# EasyEDA Pro project laserBordMain.eprj

# Schematic Schematic1
Create Date: 2023-06-17; Page Name: P1; Project Name: laserBordMain; Schematic Name: Schematic1; Update Date: 2023-08-22; Add into BOM: yes; Convert to PCB: yes; Drawed: 思达; Page Size: A3; Reviewed: 思达; Version: v1.0
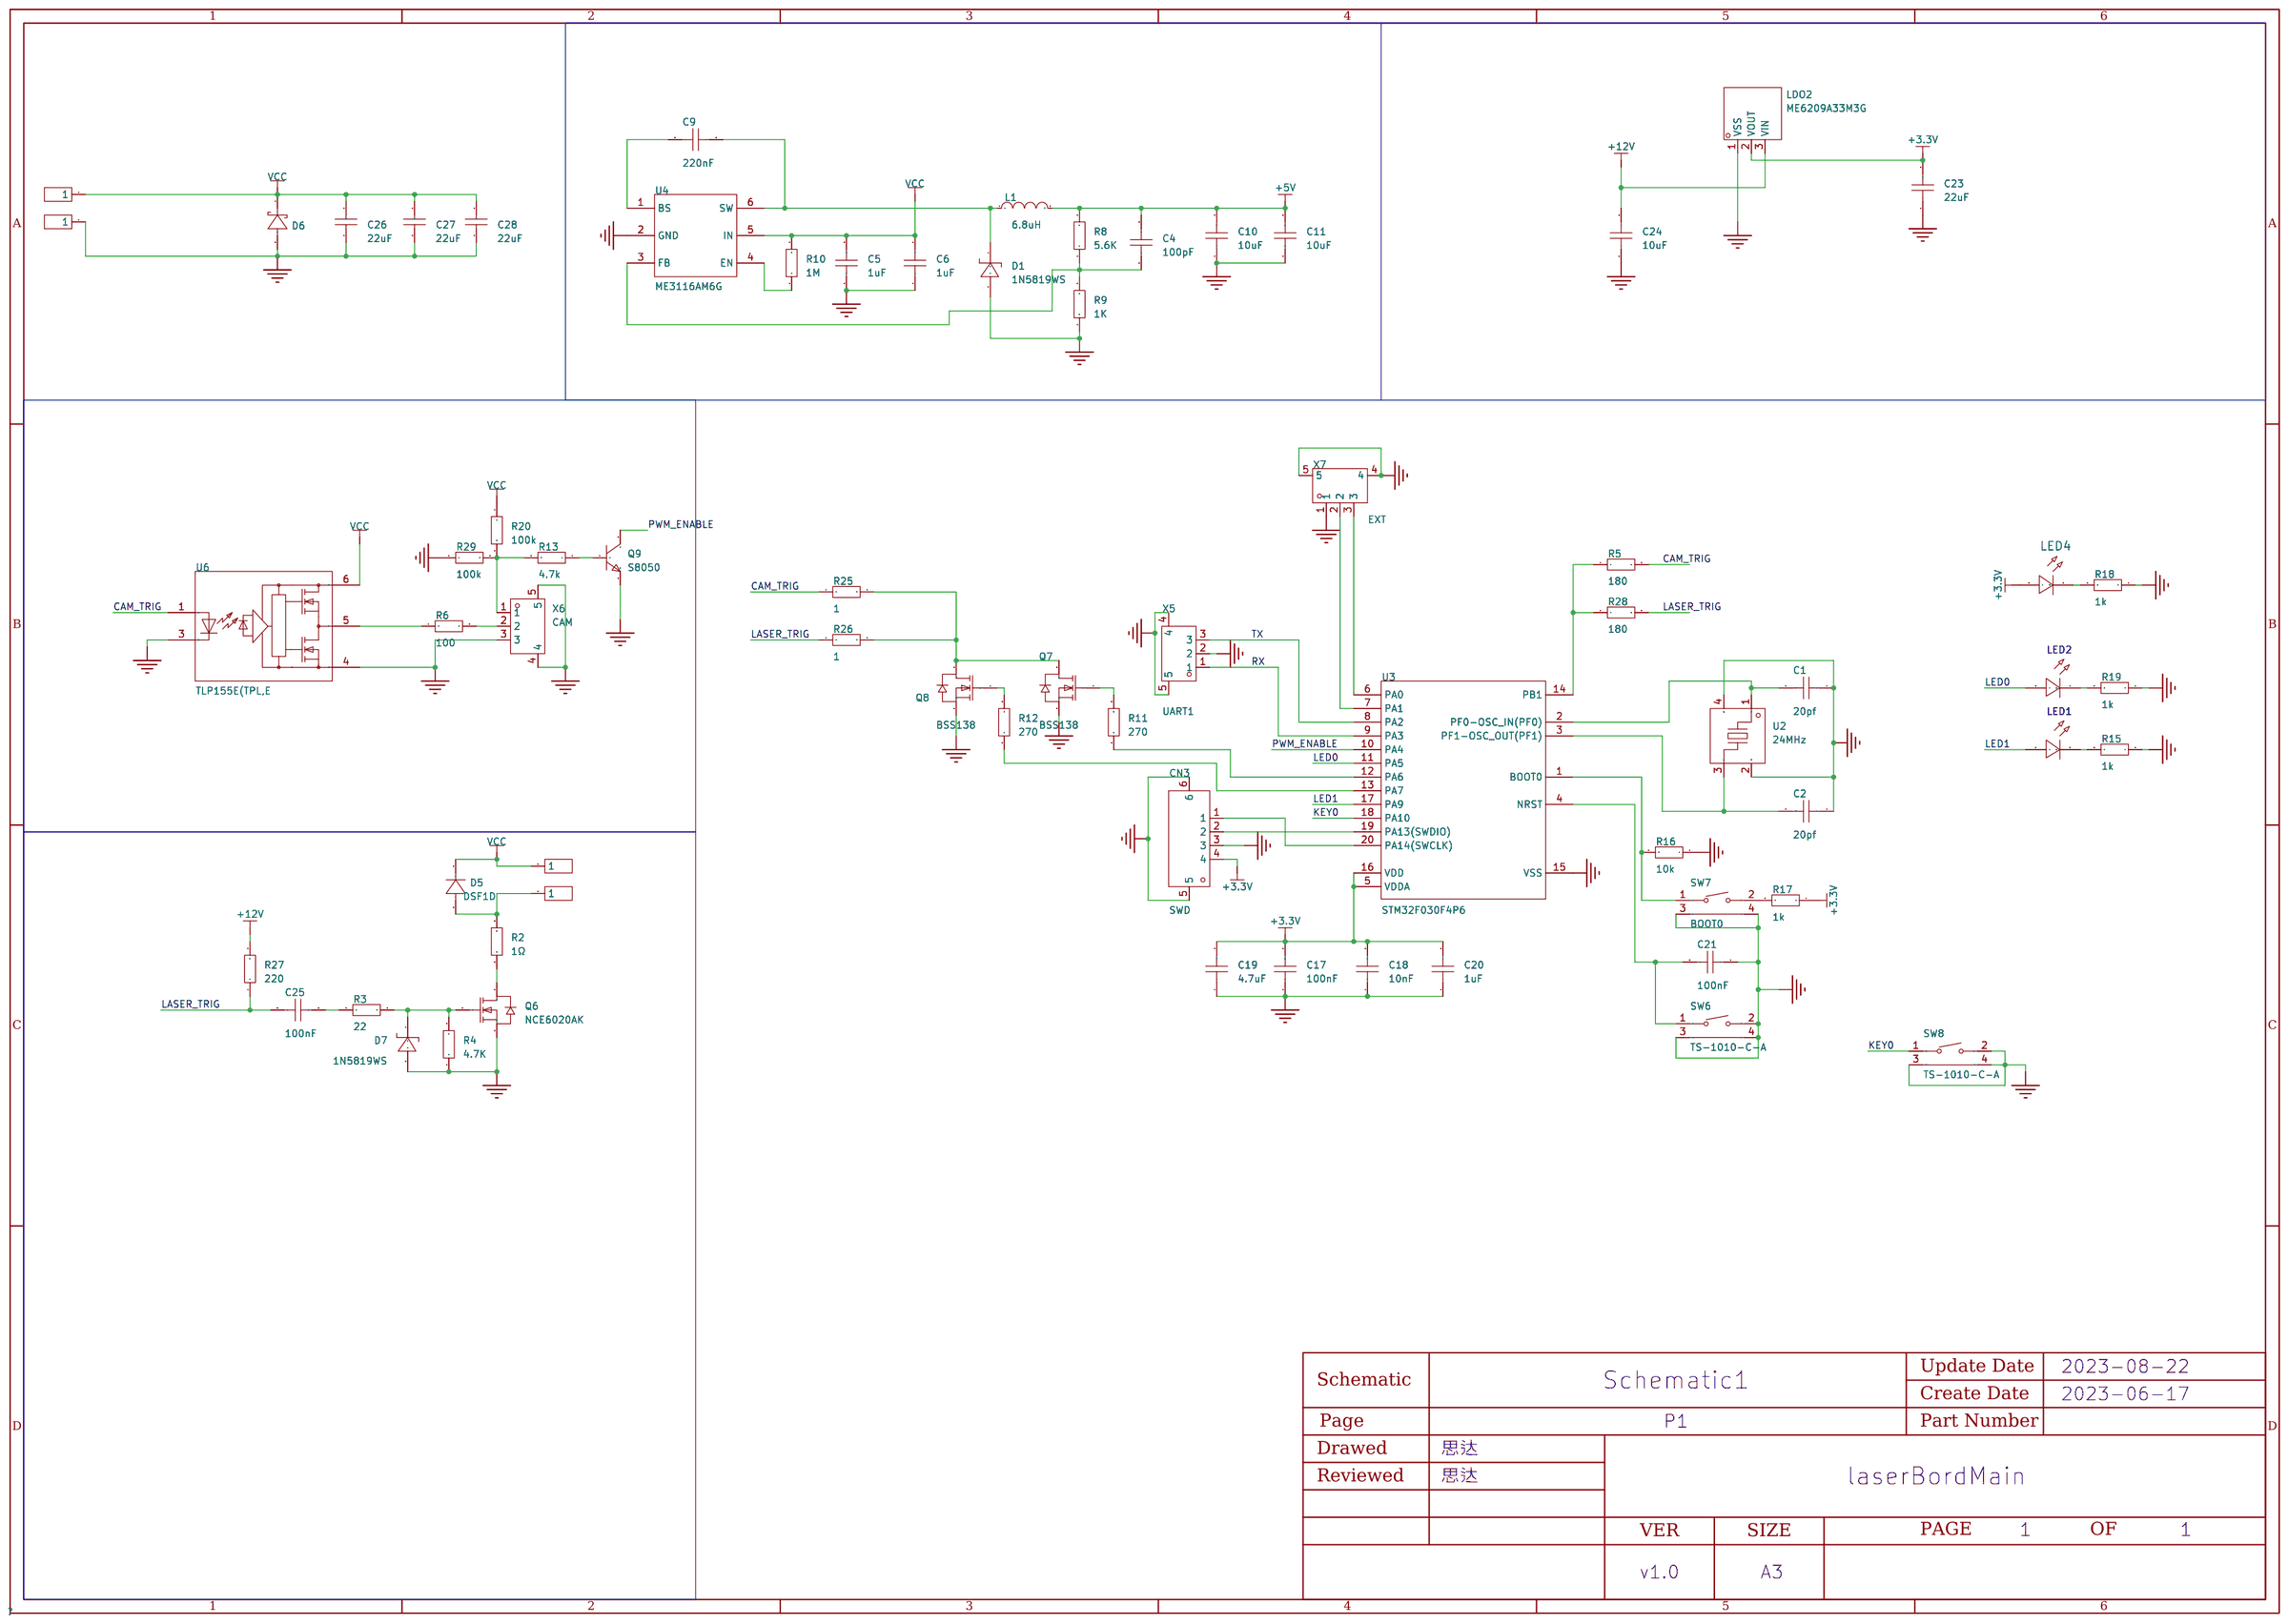
[diagram p0: schematic sheet]

## Parts
C1  20pf  [C0603]
C2  20pf  [C0603]
C4  100pF  [C0603]
C5  1uF  [C0805]
C6  1uF  [C0805]
C9  220nF  [C0603]
C10  10uF  [C0805]
C11  10uF  [C0805]
C17  100nF  [C0603]
C18  10nF  [C0603]
C19  4.7uF  [C0603]
C20  1uF  [C0603]
C21  100nF  [C0603]
C23  22uF  [C0603]
C24  10uF  [C0805]
C25  100nF  [C0603]
C26  22uF  [C1210]
C27  22uF  [C1210]
C28  22uF  [C1210]
CN3  SWD  [CONN-SMD_4P-P1.27_GH125-S04DCA-00]
D1  1N5819WS  [SOD-323_L1.8-W1.3-LS2.5-RD]
D5  DSF1D  [SOD-123_L2.8-W1.8-LS3.7-RD]
D6  SMAJ28A  [D-FLAT_L4.3-W2.6-LS5.3-RD]
D7  1N5819WS  [SOD-323_L1.8-W1.3-LS2.5-RD]
H1  -  [xt30_1p]
H2  -  [xt30_1p]
H3  -  [xt30_1p]
H4  -  [xt30_1p]
L1  6.8uH  [L1206]
LDO2  ME6209A33M3G  [SOT-23-3_L2.9-W1.6-P1.90-LS2.8-BR]
LED1  -  [LED_0603]
LED2  -  [LED_0603]
LED4  -  [LED_0603]
Q6  NCE6020AK  [TO-252-2_L6.6-W6.1-P4.57-LS10.1-TL-CW]
Q7  BSS138  [SOT-23-3_L2.9-W1.3-P1.90-LS2.4-BR]
Q8  BSS138  [SOT-23-3_L2.9-W1.3-P1.90-LS2.4-BR]
Q9  S8050  [SOT-23-3_L2.9-W1.6-P1.90-LS2.8-BR]
R2  1Ω  [R2010]
R3  22  [R0603]
R4  4.7K  [R0603]
R5  180  [R0603]
R6  100  [R0603]
R8  5.6K  [R0603]
R9  1K  [R0603]
R10  1M  [R0603]
R11  270  [R0603]
R12  270  [R0603]
R13  4.7k  [R0603]
R15  1k  [R0603]
R16  10k  [R0603]
R17  1k  [R0603]
R18  1k  [R0603]
R19  1k  [R0603]
R20  100k  [R0603]
R25  1  [R0603]
R26  1  [R0603]
R27  220  [R0603]
R28  180  [R0603]
R29  100k  [R0603]
SW6  TS-1010-C-A  [KEY-SMD_TX-1010-X-X]
SW7  BOOT0  [KEY-SMD_TX-1010-X-X]
SW8  TS-1010-C-A  [KEY-SMD_TX-1010-X-X]
U2  24MHz  [CRYSTAL-SMD_4P-L3.2-W2.5-BL]
U3  STM32F030F4P6  [TSSOP-20_L6.5-W4.4-P0.65-LS6.4-BL]
U4  ME3116AM6G  [SOT-23-6_L2.9-W1.6-P0.95-LS2.8-BL]
U6  TLP155E(TPL,E  [OPTO-SMD-5_L3.7-W4.6-P1.27-LS7.0-BR]
X5  UART1  [CONN-SMD_3P-P1.25_JUSHUO_GH125-S03DCA-00]
X6  CAM  [CONN-SMD_3P-P1.25_JUSHUO_GH125-S03DCA-00]
X7  EXT  [CONN-SMD_3P-P1.25_JUSHUO_GH125-S03DCA-00]

## Library data of the parts
C1 C2 C4 C9 C17-C21 C23 C25 = CAP_0603: Supplier Footprint: 0603
C5 C6 C10 C11 C24 = CAP_0805: Supplier Footprint: 0805
C26-C28 = GRM32DR71E106KA12L: 容值:10uF;精度:±10%;额定电压:25V;材质(温度系数):X7R;; LCSC Part Name: 10uF ±10% 25V; Supplier Part: C77100; Manufacturer: muRata(村田); Supplier Footprint: 1210; JLCPCB Part Class: Extended Part; Datasheet: https://atta.szlcsc.com/upload/public/pdf/source/20180326/C77100_23744D319E7E81B64F64A3609BA2ABFD.pdf; Supplier: LCSC; Tolerance: ±10%; Voltage Rated: 25V; Temperature Coefficient: X7R
CN3 = GH125-S04DCA-00: 参考系列:-;间距:1.25mm;插针结构:1x4P;排数:1;每排PIN数:4;行距:-;公母:公型插针;安装方式:卧贴;额定电流:1A;工作温度范围:-25℃~+85℃;; LCSC Part Name: GH1.25卧式贴片 带扣; Supplier Part: C2886767; Manufacturer: JS(钜硕电子); Supplier Footprint: SMD,P=1.25mm; JLCPCB Part Class: Extended Part; Datasheet: https://atta.szlcsc.com/upload/public/pdf/source/20210818/CD11791E5ED3EDF45A7009E9C8A2BD4C.pdf; Supplier: LCSC; Pitch: 1.25mm; Pins Structure: 1x4P; Number of Rows: 1; Number of PINs Per Row: 4; Gender: 公型插针; Mounting Style: 卧贴; Current Rating (Max): 1A; Operating Temperature Range: -25℃~+85℃
D1 D7 = 1N5819WS_C191023: 直流反向耐压(Vr):40V;平均整流电流(Io):1A;正向压降(Vf):600mV@1A;; LCSC Part Name: 40V 1A 600mV@1A; Supplier Part: C191023; Manufacturer: Hottech(合科泰); Supplier Footprint: SOD-323; JLCPCB Part Class: Basic Part; Datasheet: https://atta.szlcsc.com/upload/public/pdf/source/20220428/3CB86FD8D28D653594B4E35F9D5AEFD9.pdf; Supplier: LCSC; Reverse Voltage (Vr): 40V; Average Rectified Current (Io): 1A; Forward Voltage (Vf@If): 600mV@1A
D5 = DSF1D_C915614: 二极管配置:独立式;直流反向耐压(Vr):200V;平均整流电流(Io):1A;正向压降(Vf):950mV@1A;反向恢复时间(trr):35ns;; LCSC Part Name: 200V 1A 950mV@1A 35ns; Supplier Part: C915614; Manufacturer: FUXINSEMI(富芯森美); Supplier Footprint: SOD-123; JLCPCB Part Class: Extended Part; Datasheet: https://atta.szlcsc.com/upload/public/pdf/source/20220617/70FC00B35BDEA29A28FAEA4D4AB0042F.pdf; Supplier: LCSC; Diode Configuration: 独立式; Reverse Voltage (Vr): 200V; Average Rectified Current (Io): 1A; Forward Voltage (Vf@If): 950mV@1A; Reverse Leakage Current: 5uA@200V; Reverse Recovery Time (trr): 35ns; Operating Temperature: -55℃~+150℃@(Tj)
D6 = SMAJ28A_C1509532: Supplier Part: C1509532; Manufacturer: CJ(江苏长电/长晶); Supplier Footprint: SMAG; JLCPCB Part Class: Extended Part; Datasheet: https://atta.szlcsc.com/upload/public/pdf/source/20201222/C1509524_968BB56F728900F8495A6D352AF0B0FB.pdf; Supplier: LCSC
H1-H4 = HDR-M_2.54_1x1P: Supplier Part: C81276; Supplier Footprint: 插件; JLCPCB Part Class: Extended Part
L1 = L_1206
LDO2 = ME6209A33M3G: 输出类型:固定;输出极性:正;最大输入电压:18V;输出电压:3.3V;输出电流:250mA;电源纹波抑制比(PSRR):-;; LCSC Part Name: 正 Vin=18V Vout=3.3V 250mA; Supplier Part: C83508; Manufacturer: MICRONE(南京微盟); Supplier Footprint: SOT-23-3L; JLCPCB Part Class: Extended Part; Datasheet: https://atta.szlcsc.com/upload/public/pdf/source/20161212/1481539101152.pdf; Supplier: LCSC; Output Type: 固定; Output Polarity: 正; Number of Outputs: 1; Maximum Input Voltage: 18V; Output Voltage: 3.3V; Dropout Voltage: 80mV@(40mA); Output Current: 250mA
LED1 LED2 = LED_0603-B: Supplier Footprint: 0603
LED4 = LED_0603-R: Supplier Footprint: 0603
Q6 = NCE6020AK: 类型:N沟道;漏源电压(Vdss):60V;连续漏极电流(Id):20A;功率(Pd):45W;导通电阻(RDS(on)@Vgs,Id):35mΩ@10V,20A;阈值电压(Vgs(th)@Id):2.5V@250uA;; LCSC Part Name: N沟道 60V 20A; Supplier Part: C108639; Manufacturer: NCE(无锡新洁能); Supplier Footprint: TO-252-2(DPAK); JLCPCB Part Class: Extended Part; Datasheet: https://atta.szlcsc.com/upload/public/pdf/source/20170508/1494211006052.pdf; Supplier: LCSC; Type: N沟道; Drain Source Voltage (Vdss): 60V; Continuous Drain Current (Id): 20A; Power Dissipation (Pd): 45W; Drain Source On Resistance (RDS(on)@Vgs,Id): 35mΩ@10V,20A; Gate Threshold Voltage (Vgs(th)@Id): 2.5V@250uA
Q7 Q8 = BSS138_C78284: 类型:N沟道;漏源电压(Vdss):50V;连续漏极电流(Id):220mA;功率(Pd):360mW;导通电阻(RDS(on)@Vgs,Id):3.5Ω@10V,220mA;; LCSC Part Name: N沟道 50V 220mA; Supplier Part: C78284; Manufacturer: CJ(江苏长电/长晶); Supplier Footprint: SOT-23; JLCPCB Part Class: Extended Part; Datasheet: https://atta.szlcsc.com/upload/public/pdf/source/20160713/1468379865905.pdf; Supplier: LCSC; Type: N沟道; Drain Source Voltage (Vdss): 50V; Continuous Drain Current (Id): 220mA; Power Dissipation (Pd): 360mW; Drain Source On Resistance (RDS(on)@Vgs,Id): 3.5Ω@10V,220mA; Gate Threshold Voltage (Vgs(th)@Id): 1.5V@1mA
Q9 = S8050_C105433: 晶体管类型:NPN;集射极击穿电压(Vceo):25V;集电极电流(Ic):500mA;功率(Pd):300mW;直流电流增益(hFE@Ic,Vce):120@50mA,1V;; LCSC Part Name: NPN 25V 500mA L档 120-200; Supplier Part: C105433; Manufacturer: CJ(江苏长电/长晶); Supplier Footprint: SOT-23; JLCPCB Part Class: Extended Part; Datasheet: https://atta.szlcsc.com/upload/public/pdf/source/20170415/1492237762328.pdf; Supplier: LCSC; Transistor Type: NPN; Collector-Emitter Breakdown Voltage (Vceo): 25V; Collector Current (Ic): 500mA; Power Dissipation (Pd): 300mW; Collector Cut-Off Current (Icbo): 100nA; Collector-Emitter Saturation Voltage (VCE(sat)@Ic,Ib): 600mV@500mA,50mA; DC Current Gain (hFE@Ic,Vce): 120@50mA,1V; Transition Frequency (fT): 150MHz; Operating Temperature: +150℃@(Tj)
R2 = 201007J0000T4E: 电阻类型:厚膜电阻;阻值:0Ω;精度:±5%;功率:750mW;; LCSC Part Name: 0Ω ±5% 750mW; Supplier Part: C270958; Manufacturer: UNI-ROYAL(厚声); Supplier Footprint: 2010; JLCPCB Part Class: Extended Part; Datasheet: https://atta.szlcsc.com/upload/public/pdf/source/20200306/C422600_1E6D84923E4A46A82E41ADD87F860B5C.pdf; Supplier: LCSC; Type: 厚膜电阻; Tolerance: ±5%; Power(Watts): 750mW; Overload Voltage (Max): 200V; Operating Temperature Range: -55℃~+155℃
R3-R6 R8-R13 R15-R20 R25-R29 = Res_0603: Supplier Footprint: 0603
SW6-SW8 = TS-1010-C-A: 触点电流:50mA;额定电压(DC):12V;绝缘电阻:-;电路结构:单刀单掷;安装方式:卧贴;带灯:无;作用力:260gf;机械寿命:10万次;带支架:否;; LCSC Part Name: 卧贴 2*4*3.5mm 轻触开关; Supplier Part: C692458; Manufacturer: XKB Connectivity(中国星坤); Supplier Footprint: SMD; JLCPCB Part Class: Extended Part; Datasheet: https://atta.szlcsc.com/upload/public/pdf/source/20211011/09621D275CE0F472C941775DFBBCCC96.pdf; Supplier: LCSC; Contact Current: 50mA; Voltage Rating (DC): 12V; Circuit: 单刀单掷; Mounting Style: 卧贴; Actuator Style: 矩形按钮; Actuator/Cap Color: 黑色; With Lamp: 无; Operating Force: 260gf; Mechanical Life: 10万次; Operating Temperature: -30℃~+85℃; Switch Length: 2mm; Switch Width: 4mm; Switch Height: 3.5mm; Strike Gundam: 否
U2 = XXHCCLNANF-24MHZ: 频率:24MHz;频率公差:±20ppm;负载电容:20pF;; Supplier Part: C5160135; Manufacturer: TAITIEN(泰艺电子); Supplier Footprint: SMD3225-4P; JLCPCB Part Class: Extended Part; Datasheet: https://atta.szlcsc.com/upload/public/pdf/source/20221011/C6169EE059BEE5ABCF35F509F47C6D34.pdf; Supplier: LCSC; Crystal Type: 贴片无源晶振; Frequency Tolerance: ±20ppm; Frequency Stability: ±20ppm; Load Capacitance: 20pF; Operating Temperature: -40℃~+85℃
U3 = STM32F030F4P6: CPU内核:ARM Cortex-M0;CPU最大主频:48MHz;程序存储容量:16KB;程序存储器类型:FLASH;RAM总容量:4KB;GPIO端口数量:15;; LCSC Part Name: ARM Cortex-M0 48MHz; Supplier Part: C32908; Manufacturer: ST(意法半导体); Supplier Footprint: TSSOP-20; JLCPCB Part Class: Extended Part; Datasheet: https://atta.szlcsc.com/upload/public/pdf/source/20140704/1457707098580.pdf; Supplier: LCSC; CPU Core: ARM Cortex-M0; CPU Maximum Speed: 48MHz; Operating Voltage Range: 2.4V~3.6V; Program Storage Size: 16KB; Program Memory Type: FLASH; RAM Size: 4KB; GPIO Ports Number: 15; ADC (Bit): 12bit; Watchdog: 有; Low-Voltage Detect: 有; Direct Memory Access: 有; Internal Oscillator: 有; Operating Temperature Range: -40℃~+85℃
U4 = ME3116AM6G_C97643: 功能类型:降压型;同步整流:-;输出通道数:-;拓扑结构:-;输入电压:-;输出电流(最大值):-;开关频率:-;; LCSC Part Name: 降压型; Supplier Part: C97643; Manufacturer: MICRONE(南京微盟); Supplier Footprint: SOT-23-6; JLCPCB Part Class: Extended Part; Datasheet: https://atta.szlcsc.com/upload/public/pdf/source/20170322/1490151692992.pdf; Supplier: LCSC; Function: 降压型
U6 = TLP155E(TPL,E: Supplier Part: C56499; Manufacturer: TOSHIBA(东芝); Supplier Footprint: SO-5; JLCPCB Part Class: Extended Part; Datasheet: https://atta.szlcsc.com/upload/public/pdf/source/20150821/1457707350132.pdf; Supplier: LCSC
X5-X7 = GH125-S03DCA-00: 参考系列:-;间距:1.25mm;插针结构:1x3P;排数:1;每排PIN数:3;行距:-;公母:公型插针;安装方式:卧贴;额定电流:1A;工作温度范围:-25℃~+85℃;; LCSC Part Name: GH1.25卧式贴片 带扣; Supplier Part: C2886766; Manufacturer: JS(钜硕电子); Supplier Footprint: SMD,P=1.25mm; JLCPCB Part Class: Extended Part; Datasheet: https://atta.szlcsc.com/upload/public/pdf/source/20210818/CD11791E5ED3EDF45A7009E9C8A2BD4C.pdf; Supplier: LCSC; Pitch: 1.25mm; Pins Structure: 1x3P; Number of Rows: 1; Number of PINs Per Row: 3; Gender: 公型插针; Mounting Style: 卧贴; Current Rating (Max): 1A; Operating Temperature Range: -25℃~+85℃

## Nets
+3.3V: C17.2 C18.2 C19.2 C20.2 C23.2 CN3.4 LDO2.2(VOUT) LED4.2(A) R17.1 U3.5(VDDA) U3.16(VDD)
+5V: C4.2 C10.2 C11.2 L1.2 R8.2
+12V: C24.2 LDO2.3(VIN) R27.2
GND: C1.1 C2.1 C5.1 C6.1 C10.1 C11.1 C17.1 C18.1 C19.1 C20.1 C21.1 C23.1 C24.1 C26.1 C27.1 C28.1 CN3.3 CN3.5 CN3.6 D1.2(A) D6.2(K) D7.2(A) H2.1 LDO2.1(VSS) Q6.3(S) Q7.2(S) Q8.2(S) Q9.2 R4.1 R9.1 R15.1 R16.1 R18.1 R19.1 R29.1 SW6.2 SW6.3 SW6.4 SW7.3 SW7.4 SW8.2 SW8.3 SW8.4 U2.2(GND) U2.4(GND) U3.15(VSS) U4.2(GND) U6.3(CAT) U6.4(GND) X5.2 X5.4 X5.5 X6.3 X6.4 X6.5 X7.1 X7.4 X7.5
VCC: C5.2 C6.2 C26.2 C27.2 C28.2 D5.1(K) D6.1(A) H1.1 H3.1 R10.2 R20.1 U4.5(IN) U6.6(VCC)
CAM_TRIG: R5.2 R25.1 U6.1(AN)
KEY0: SW8.1 U3.18(PA10)
LASER_TRIG: C25.1 R26.1 R27.1 R28.2
LED0: LED2.2(A) U3.11(PA5)
LED1: LED1.2(A) U3.17(PA9)
PWM_ENABLE: Q9.3 U3.10(PA4)
RX: U3.9(PA3) X5.1
TX: U3.8(PA2) X5.3
$1N1626: C2.2 U2.3 U3.3(PF1-OSC_OUT(PF1))
$1N1631: C1.2 U2.1 U3.2(PF0-OSC_IN(PF0))
$1N4476: D5.2(A) H4.1 R2.2
$1N5670: Q6.2(D) R2.1
$1N6510: R10.1 U4.4(EN)
$1N6730: C9.1 U4.1(BS)
$1N6734: C9.2 D1.1(C) L1.1 U4.6(SW)
$1N6947: C4.1 R8.1 R9.2 U4.3(FB)
$1N7197: Q8.1(G) R12.2
$1N7201: Q7.1(G) R11.2
$1N8162: CN3.1 U3.20(PA14(SWCLK))
$1N8168: CN3.2 U3.19(PA13(SWDIO))
$1N8540: R16.2 SW7.1 U3.1(BOOT0)
$1N8553: C21.2 SW6.1 U3.4(NRST)
$1N8819: R17.2 SW7.2
$1N8855: R11.1 U3.12(PA6)
$1N8868: R12.1 U3.13(PA7)
$1N8989: LED4.1(C) R18.2
$1N12018: LED2.1(C) R19.2
$1N12023: LED1.1(C) R15.2
$1N16258: U3.7(PA1) X7.2
$1N16262: U3.6(PA0) X7.3
$1N21791: Q9.1 R13.1
$1N21794: R13.2 R20.2 R29.2 X6.1
$1N21871: R6.1 U6.5(VO)
$1N21926: R6.2 X6.2
$1N25303: Q7.3(D) Q8.3(D) R25.2 R26.2
$1N25434: R5.1 R28.1 U3.14(PB1)
$1N26982: D7.1(C) Q6.1(G) R3.2 R4.2
$1N26993: C25.2 R3.1

# Board PCB1
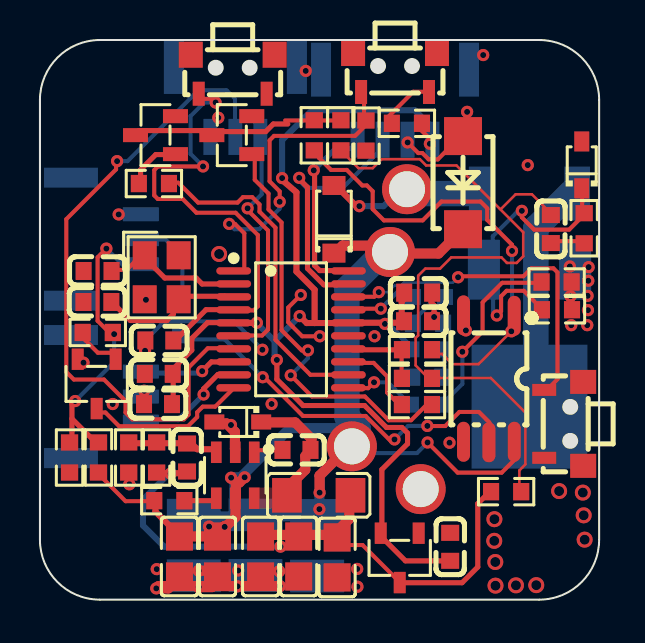
[diagram p1: board, top side]
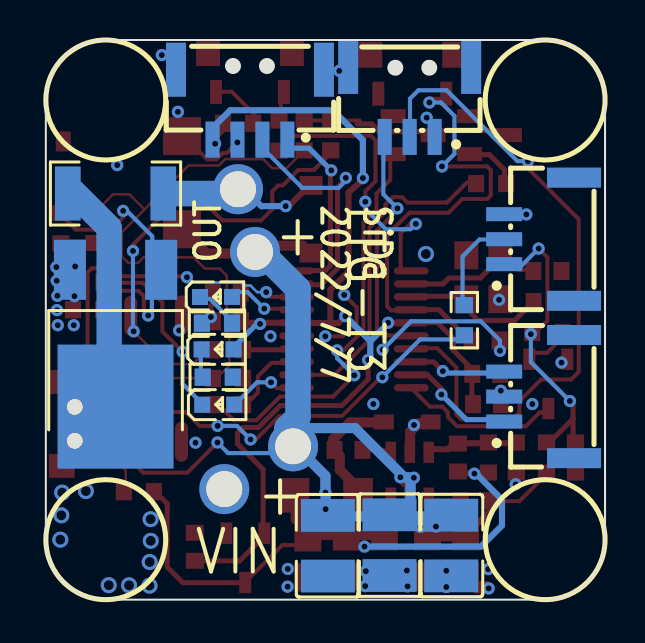
[diagram p2: board, bottom side, seen from below]

Outline 28 x 28 mm; copper layers: Top Layer, Bottom Layer. Coordinates in mm from the lower left corner of the outline.
Outline path: 0,25 arc(0.88,27.12) 3,28 25,28 arc(27.12,27.12) 28,25 28,3 arc(27.12,0.88) 25,0 3,0 arc(0.88,0.88) 0,3 0,25
Stack: Top Layer 0.035mm / Dielectric1 1.11mm FR4 er 4.5 / Bottom Layer 0.035mm

## Design rules (mm)
template: 自定义配置
spacing copperThickness1oz (default): track to track 0.102, other pairs 0.152 to 0.3
spacing copperThickness2oz: track to track 0.203, other pairs 0.152 to 0.3
track width copperThickness1oz (default): min 0.127, default 0.254, max 2.54
track width copperThickness2oz: min 0.203, default 0.254, max 2.54
differential pair differentialPair (default): width min 0.127, default 0.254, max 2.54; gap min 0.152, default 0.152
via viaSize (default): diameter min 0.5, default 0.61, max 10; hole min 0.3, default 0.305, max 6.3
net GND uses copperRegion1

## Placement (name value [footprint] x y rotation side)
C1  20pf  [C0603]  2.89 16.44 0 top
C2  20pf  [C0603]  2.88 14.89 0 top
C4  100pF  [C0603]  7.37 7.11 270 top
C5  1uF  [C0805]  6.98 2.16 90 top
C6  1uF  [C0805]  8.89 2.16 90 top
C9  220nF  [C0603]  12.85 7.49 0 top
C10  10uF  [C0805]  11.05 2.16 90 top
C11  10uF  [C0805]  12.95 2.16 90 top
C17  100nF  [C0603]  18.94 15.36 180 top
C18  10nF  [C0603]  5.95 11.3 0 top
C19  4.7uF  [C0603]  18.93 13.93 180 top
C20  1uF  [C0603]  5.91 9.78 0 top
C21  100nF  [C0603]  5.98 12.97 0 top
C23  22uF  [C0603]  20.54 2.64 270 top
C24  10uF  [C0805]  14.88 2.11 90 top
C25  100nF  [C0603]  25.58 18.54 270 top
C26  22uF  [C1210]  13.88 2.7 90 bottom
C27  22uF  [C1210]  10.79 2.72 90 bottom
C28  22uF  [C1210]  7.7 2.71 90 bottom
CN3  SWD  [CONN-SMD_4P-P1.27_GH125-S04DCA-00]  17.78 24.77 0 bottom
D1  1N5819WS  [SOD-323_L1.8-W1.3-LS2.5-RD]  9.91 8.89 180 top
D5  DSF1D  [SOD-123_L2.8-W1.8-LS3.7-RD]  14.72 19.03 90 top
D6  SMAJ28A  [D-FLAT_L4.3-W2.6-LS5.3-RD]  21.18 20.86 90 top
D7  1N5819WS  [SOD-323_L1.8-W1.3-LS2.5-RD]  27.13 21.75 90 top
H1  -  [xt30_1p]  17.53 17.4 300 top
H2  -  [xt30_1p]  19.07 5.53 270 top
H3  -  [xt30_1p]  15.62 7.67 0 top
H4  -  [xt30_1p]  18.38 20.54 0 top
L1  6.8uH  [L1206]  13.96 5.22 0 top
LDO2  ME6209A33M3G  [SOT-23-3_L2.9-W1.6-P1.90-LS2.8-BR]  18.01 2.09 90 top
LED1  -  [LED_0603]  19.43 15.15 180 bottom
LED2  -  [LED_0603]  19.32 9.76 180 bottom
LED4  -  [LED_0603]  19.35 12.53 180 bottom
Q6  NCE6020AK  [TO-252-2_L6.6-W6.1-P4.57-LS10.1-TL-CW]  24.51 13.08 270 bottom
Q7  BSS138  [SOT-23-3_L2.9-W1.3-P1.90-LS2.4-BR]  5.78 23.24 0 top
Q8  BSS138  [SOT-23-3_L2.9-W1.3-P1.90-LS2.4-BR]  9.61 23.24 0 top
Q9  S8050  [SOT-23-3_L2.9-W1.6-P1.90-LS2.8-BR]  2.84 10.8 90 top
R2  1Ω  [R2010]  24.51 20.32 180 bottom
R3  22  [R0603]  27.25 18.58 90 top
R4  4.7K  [R0603]  25.89 14.51 180 top
R5  180  [R0603]  18.88 12.51 0 top
R6  100  [R0603]  7.05 13.98 90 bottom
R8  5.6K  [R0603]  5.84 7.11 270 top
R9  1K  [R0603]  4.44 7.11 90 top
R10  1M  [R0603]  6.48 4.95 180 top
R11  270  [R0603]  5.71 20.82 180 top
R12  270  [R0603]  18.88 9.76 0 top
R13  4.7k  [R0603]  2.9 13.37 0 top
R15  1k  [R0603]  19.43 13.83 180 bottom
R16  10k  [R0603]  16.32 23.22 90 top
R17  1k  [R0603]  18.37 23.83 180 top
R18  1k  [R0603]  19.39 11.13 0 bottom
R19  1k  [R0603]  25.87 15.89 180 top
R20  100k  [R0603]  2.93 7.11 90 top
R25  1  [R0603]  13.74 23.23 90 top
R26  1  [R0603]  15.07 23.23 90 top
R27  220  [R0603]  23.34 5.4 180 top
R28  180  [R0603]  18.88 11.07 0 top
R29  100k  [R0603]  1.48 7.11 90 top
SW6  TS-1010-C-A  [KEY-SMD_TX-1010-X-X]  9.65 26.29 0 top
SW7  BOOT0  [KEY-SMD_TX-1010-X-X]  17.78 26.37 0 top
SW8  TS-1010-C-A  [KEY-SMD_TX-1010-X-X]  26.23 8.8 270 top
U2  24MHz  [CRYSTAL-SMD_4P-L3.2-W2.5-BL]  6.1 16.13 270 top
U3  STM32F030F4P6  [TSSOP-20_L6.5-W4.4-P0.65-LS6.4-BL]  12.57 13.52 270 top
U4  ME3116AM6G  [SOT-23-6_L2.9-W1.6-P0.95-LS2.8-BL]  9.78 6.22 180 top
U6  TLP155E(TPL,E  [OPTO-SMD-5_L3.7-W4.6-P1.27-LS7.0-BR]  22.48 11.05 90 top
X5  UART1  [CONN-SMD_3P-P1.25_JUSHUO_GH125-S03DCA-00]  3.3 10.16 90 bottom
X6  CAM  [CONN-SMD_3P-P1.25_JUSHUO_GH125-S03DCA-00]  3.3 18.03 90 bottom
X7  EXT  [CONN-SMD_3P-P1.25_JUSHUO_GH125-S03DCA-00]  9.78 24.9 0 bottom

## Footprints (pads in the part's own frame, mm; a bottom-side part is the same pattern mirrored in y, then rotated)
C0603
  rect 0.8x0.9 smd: 1(-0.7,0) 2(0.7,0)
C0805
  rect 1.41x1.35 smd: 1(-1,0) 2(1,0)
C1210
  rect 1.635x2.7 smd: 1(-1.518,0) 2(1.518,0)
CONN-SMD_3P-P1.25_JUSHUO_GH125-S03DCA-00
  rect 0.7x1.8 smd: 1(-1.25,1.75) 2(0,1.75) 3(1.25,1.75)
  rect 1x2.7 smd: 4(3.08,-1.75) 5(-3.08,-1.75)
CONN-SMD_4P-P1.27_GH125-S04DCA-00
  rect 0.7x1.8 smd: 1(-1.875,1.75) 2(-0.625,1.75) 3(0.625,1.75) 4(1.875,1.75)
  rect 1x2.7 smd: 5(3.705,-1.75) 6(-3.705,-1.75)
CRYSTAL-SMD_4P-L3.2-W2.5-BL
  rect 1.4x1.2 smd: 1(-1.1,-0.85) 2(1.1,-0.85) 3(1.1,0.85) 4(-1.1,0.85)
D-FLAT_L4.3-W2.6-LS5.3-RD
  rect 1.9x1.9 smd: 1(-2.33,0) 2(2.33,0)
KEY-SMD_TX-1010-X-X
  rect 0.6x1.2 smd: 1(-1.7,-0.975) 2(1.7,-0.975)
  rect 1.2x1.3 smd: 3(-2.1,0.975) 4(2.1,0.975)
L1206
  rect 1.485x1.728 smd: 1(-1.593,0) 2(1.593,0)
LED_0603
  rect 0.8x0.8 smd: 1(-0.851,-0.01) 2(0.75,-0.005)
OPTO-SMD-5_L3.7-W4.6-P1.27-LS7.0-BR
  oval 2x0.65 smd: 1(3.15,-1.27) 3(3.175,1.27) 4(-3.15,1.27) 5(-3.175,0) 6(-3.15,-1.27)
R0603
  rect 0.806x0.864 smd: 1(-0.753,0) 2(0.753,0)
R2010
  rect 1.282x2.7 smd: 1(-2.391,0) 2(2.391,0)
SOD-123_L2.8-W1.8-LS3.7-RD
  rect 0.95x1.15 smd: 1(-1.692,0) 2(1.692,0)
SOD-323_L1.8-W1.3-LS2.5-RD
  rect 1x0.75 smd: 1(-1.173,0) 2(1.173,0)
SOT-23-3_L2.9-W1.3-P1.90-LS2.4-BR
  rect 1.25x0.7 smd: 1(1,-0.95) 2(1,0.95) 3(-1,0)
SOT-23-3_L2.9-W1.6-P1.90-LS2.8-BR
  rect 1.07x0.6 smd: 1(1.235,-0.95) 2(1.235,0.95) 3(-1.235,0)
SOT-23-6_L2.9-W1.6-P0.95-LS2.8-BL
  rect 0.532x1.072 smd: 1(-0.95,-1.149) 2(0,-1.149) 3(0.95,-1.149) 4(0.95,1.149) 5(0,1.149) 6(-0.95,1.149)
TO-252-2_L6.6-W6.1-P4.57-LS10.1-TL-CW
  rect 3x1.6 smd: 1(-3.424,2.285) 3(-3.424,-2.285)
  rect 6.2x5.8 smd: 2(3.424,0)
TSSOP-20_L6.5-W4.4-P0.65-LS6.4-BL
  oval 0.364x1.742 smd: 1(-2.925,-2.871) 2(-2.275,-2.871) 3(-1.625,-2.871) 4(-0.975,-2.871) 5(-0.325,-2.871) 6(0.325,-2.871) 7(0.975,-2.871) 8(1.625,-2.871) 9(2.275,-2.871) 10(2.925,-2.871) 11(2.925,2.871) 12(2.275,2.871) 13(1.625,2.871) 14(0.975,2.871) 15(0.325,2.871) 16(-0.325,2.871) 17(-0.975,2.871) 18(-1.625,2.871) 19(-2.275,2.871) 20(-2.925,2.871)
xt30_1p
  round 2.5 hole 1.8: 1(0,0)

## Nets
As in the schematic, except:
+12V: C4.2 C10.2 C11.2 C24.2 L1.2 LDO2.3 R8.2 R27.2

## Via types
v1: diameter 0.8, hole 0.5, Top Layer to Bottom Layer, 11 vias
v2: diameter 0.61, hole 0.305, Top Layer to Bottom Layer, 83 vias

## Routing (per net, layer and track width the routed paths; a pad name or vN(x,y) marks a point on that pad's centre or on a via; arc(x,y) is an arc through that point)
+3.3V: length 55.9
  Top Layer w0.203: 19.09,23.77 19.09,23.49 19.52,23.05 v2(19.52,22.81)
  Top Layer w0.254: 9.72,13.86 8.39,13.86 7.6,13.07 7.6,12.48 6.67,11.55 6.67,9.83 6.58,9.74 ; 18.22,13.87 18.19,13.87 18.19,13.69 ; 18.08,15.39 18.08,15.42 ; 17.12,3.5 17.12,6.51 18.41,7.8 18.41,8.33 18.12,8.61 17.35,8.61 16.26,9.71 13.18,9.71 11.86,11.03 v2(11.86,11.99) ; 17.16,3.08 18.3,1.94 20.4,1.94 ; v2(17.28,13.8) 17.28,13.86 ; 18.08,15.2 18.08,15.3
  Top Layer w0.305: v2(13.01,14.19) 13.35,13.84 13.75,13.84 ; 18.14,15.24 18.08,15.3 18.08,15.39 ; 18.23,15.04 18.11,14.92 18.11,13.64 ; 18.1,13.67 17.92,13.86 16.02,13.86 ; 14.91,13.84 13.75,13.84 ; 13.75,13.84 13.75,15.5 12.84,16.42 12.84,20.38 12.1,21.01 ; v2(10.86,13.85) 10.85,13.85 10.14,13.85
  Bottom Layer w0.254: 18.58,12.64 17.43,13.8 v2(17.28,13.8)
  Bottom Layer w0.305: 11.95,12.03 11.75,12.22 11.75,12.93 ; v2(12.13,21.09) 12.13,22.99 13.62,24.49 18.77,24.49 19.52,23.73 ; 11.75,12.93 v2(13.01,14.19) ; 11.75,12.93 10.86,13.82 v2(10.86,13.85)
+12V: length 29.2
  Top Layer w0.203: 18.02,0.87 16.16,2.73 15.39,2.73
  Top Layer w0.254: 22.36,5.24 21.92,4.8 21.92,1.63 21.14,0.85 18.03,0.85
  Top Layer w0.305: 6.46,6.31 6.46,6.33 ; 6.46,6.33 7.38,6.33 ; 6.46,6.33 5.92,6.33 ; 15.16,3.14 15.16,3.14
  Top Layer w0.508: 11.1,3.24 14.69,3.24 15.49,4.03 15.49,5.19
  Bottom Layer w0.305: 6.46,6.31 5.16,5 5.16,3.71 6.22,2.65 v2(12.04,2.65)
  vias: v2(6.54,6.3)
GND: length 24.9
  Top Layer w0.203: v2(18.41,22.88) 18.94,22.34 19.15,22.34 19.46,22.03 19.92,22.03 20.36,22.47 20.48,22.47 ; v2(14.01,13.18) 13.13,13.18 12.43,13.88 12.43,14.62 v2(13.06,15.25)
  Top Layer w0.254: 19.57,14.89 19.74,14.72 v2(19.74,14.14)
  Top Layer w0.508: 8.67,0.68 8.62,0.63 v2(7.95,0.63) ; 8.67,0.68 6.54,0.68 ; 8.67,0.68 v2(12.01,0.68) ; 8.67,0.68 8.7,0.7 ; v2(7.95,1.45) 8.69,1.45 8.71,1.46 ; 6.54,0.68 6.67,0.82 ; 6.54,0.68 6.42,0.56 v2(5.83,0.56) 5.94,0.68 6.54,0.68 ; 9.79,7.53 9.76,7.55 9.76,8.39 9.34,8.82 8.93,8.82
  Bottom Layer w0.203: v2(5.26,12.45) 5.26,12.97 6.22,13.93 9.71,13.93 v2(11.14,12.5)
  vias: v1(8.97,17.29) v1(22.75,4.03) v1(22.75,2.94) v1(22.8,1.88) v1(22.81,0.7) v1(23.83,0.72) v1(24.85,0.73) v1(26,5.43) v1(27.18,5.36) v1(27.23,4.22) v1(27.27,3) v2(2.18,11.86) v2(3.64,9.79) v2(3.94,19.27) v2(4.48,5.77) v2(5.22,10.45) v2(5.31,15) v2(5.85,1.53) v2(8.93,24.11) v2(9.57,8.74) v2(9.89,0.67) v2(9.92,1.46) v2(11.6,9.79) v2(11.98,1.42) v2(13.31,26.46) v2(15.89,1.54) v2(15.9,0.65) v2(16.75,13.18) v2(20.51,7.85) v2(21.39,24.41) v2(21.33,13.47) v2(22.19,27.25) v2(24.43,21.74) v2(26.53,16.67) v2(26.57,15.19) v2(26.6,13.73) v2(27.42,15.2) v2(27.41,13.73) v2(27.47,16.64) v2(27.46,15.95) v2(27.44,14.48)
VCC: length 58.9
  Top Layer w0.203: 5.67,4.93 4.29,4.93 2.91,6.3 ; 23.87,7.11 23.12,6.36 20.92,6.36 v2(19.41,7.86)
  Top Layer w0.305: 6.99,3.19 5.78,4.4 5.78,4.92
  Top Layer w0.508: 21,18.36 19.96,17.32 18.18,17.32 ; 9.81,5.86 9.99,5.86 v2(10.25,6.12) ; 9.81,5.86 9.81,5.08 ; 9.81,5.86 v2(9.57,6.1) ; 14.82,17.37 15.16,17.71 17.38,17.71 ; v2(14,5.36) 14,6.21 16.04,8.25 ; 8.66,3.17 7.14,3.17 7.1,3.13 ; 9.79,4.83 9.79,4.14 9.14,3.48
  Bottom Layer w0.203: v2(19.41,7.86) 18.88,7.33 16.05,7.33
  Bottom Layer w0.508: 15.06,7.25 14,6.19 v2(14,5.36) 13.99,5.34 v2(13.99,4.53) ; 9.74,4.68 9.74,5.94 v2(9.57,6.1) ; 9.57,6.12 10.06,6.12 12.52,8.58 16.24,8.58 ; 14.16,4.27 14.06,4.17 8.13,4.17
  Bottom Layer w1.27: 15.73,7.92 15.73,8.39 15.93,8.58 15.38,9.13 15.38,15.55 17.79,17.96
  vias: v2(8.47,3.66) v2(9.25,3.64)
CAM_TRIG: length 22.2
  Top Layer w0.127: v2(23.6,13.42) 21.96,11.78 20.65,11.78 20.14,12.29 19.89,12.29
  Top Layer w0.203: v2(23.64,17.45) 23.64,17.76 22.4,19 22.4,19.58 22.06,19.92 20.11,19.92 19.16,18.98 17.22,18.98 16.66,19.54 16.66,20.43 16.37,20.72 16.14,20.72 15.36,21.5 14.58,21.5 13.97,22.11 13.97,22.19
  Bottom Layer w0.203: v2(23.6,13.42) 23.64,13.46 v2(23.64,17.45)
KEY0: length 16.4
  Top Layer w0.203: 25.59,10.7 25.91,11.03 25.91,16.38 25.71,16.58 24.61,16.58 24.21,16.18 21.12,16.18 21.04,16.26 ; v2(16.97,15.38) 16.74,15.16 15.96,15.16
  Bottom Layer w0.127: v2(20.94,16.13) 20.67,15.86 18.22,15.86 18.07,15.72 17.75,15.72 17.42,15.38 v2(16.97,15.38)
LASER_TRIG: length 36.2
  Top Layer w0.127: 25.61,19.3 24.63,20.28 23.82,20.28 23.08,19.54 23.04,19.54 ; 19.6,10.93 18.81,11.72 18.81,13.09 18.94,13.22 18.94,16.2 19.3,16.56 20.03,16.56 20.6,17.12 23.11,17.12 23.38,16.85 23.87,16.85 24.2,17.18 24.2,18.38 20.86,21.72 19.34,21.72 19.02,22.04 17.11,22.04 16.66,21.59 15.94,21.59 15.32,22.21 ; 19.75,11.09 22.57,11.09 24.3,9.36 24.3,6.77 24,6.47 24,5.45
LED0: length 3.2
  Top Layer w0.203: 15.78,10.58 16.43,10.58 v2(16.73,10.87)
  Bottom Layer w0.203: v2(16.73,10.87) 17.43,10.87 18.41,9.89
LED1: length 3.2
  Top Layer w0.203: v2(17.07,14.56) 16.09,14.56 15.98,14.45
  Bottom Layer w0.203: v2(17.07,14.56) 17.89,15.38 18.8,15.38
PWM_ENABLE: length 8.2
  Top Layer w0.203: 2.94,9.36 3.28,9.36 3.97,8.68 7.41,8.68 7.87,9.14 7.87,9.38 8.15,9.66 8.77,9.66 9.69,10.58 ; 2.94,9.36 2.84,9.36 ; 2.94,9.36 2.94,9.49
RX: length 5.5
  Top Layer w0.254: v2(8.19,10.26) 8.19,10.55 8.91,11.26 9.79,11.26
  Bottom Layer w0.254: v2(8.19,10.26) 6.94,9.01 5.42,9.01
TX: length 4.6
  Top Layer w0.254: v2(8.12,11.43) 8.58,11.89 9.79,11.89
  Bottom Layer w0.254: 5.4,11.34 8.02,11.34 v2(8.12,11.43)
$1N1626: length 7.3
  Top Layer w0.254: 7.17,15.18 9.25,15.18 9.29,15.13 9.72,15.13 ; 3.4,14.95 3.54,14.95 4.53,13.97 6.35,13.97 6.69,14.3 6.69,15.18
$1N1631: length 5.8
  Top Layer w0.203: 4.84,17 4.34,16.5 3.67,16.5
  Top Layer w0.254: 9.46,15.79 8.12,15.79 7.82,16.09 6.25,16.09 5.49,16.85
$1N4476: length 6.3
  Top Layer w0.305: 14.78,20.75 15.84,19.69 v2(15.99,19.69)
  Bottom Layer w0.305: 17.74,20.22 17.21,19.69 v2(15.99,19.69)
  Bottom Layer w1.27: 19.2,20.37 19.25,20.32 21.86,20.32
$1N5670: length 8.8
  Bottom Layer w1.27: 24.83,12.39 24.83,18.61 26.64,20.42
$1N6510: length 1.6
  Top Layer w0.254: U4.4 8.71,4.95 R10.1
$1N6730: length 1.5
  Top Layer w0.203: 12.22,7.54 12.16,7.47 10.73,7.47
$1N6734: length 5.7
  Top Layer w0.508: 13.56,7.46 13.28,7.18 13.28,6.5 12.57,5.78 ; 13.56,7.46 13.6,8.05 12.78,8.87 11.04,8.87 11.01,8.84 ; 13.56,7.46 13.56,7.5
$1N6947: length 4.6
  Top Layer w0.305: 4.26,7.84 4.27,7.83 7.38,7.83 ; 7.53,7.87 7.88,7.53 8.84,7.53
$1N7197: length 21.1
  Top Layer w0.203: 10.76,22.2 10.76,21.01 11.44,20.32 11.44,19.52 12.1,18.87 12.1,13.48 13.11,12.47 v2(13.42,12.47) ; 19.77,9.87 19.48,9.87 18.58,8.98 17.46,8.98 16.27,10.16 13.62,10.16 v2(12.56,11.22)
  Bottom Layer w0.203: v2(12.56,11.22) 13.42,12.09 v2(13.42,12.47)
$1N7201: length 3.2
  Top Layer w0.254: 5.04,20.71 5.04,21.51 5.8,22.27 7.12,22.27
$1N8162: length 9
  Top Layer w0.254: 13.75,21.45 13.75,16.72 14.01,16.46 15.27,16.46
  Bottom Layer w0.254: v2(13.71,21.48) 14.82,22.59 15.91,22.59
$1N8168: length 11.7
  Top Layer w0.254: 14.9,15.8 14.85,15.75 14.22,15.75 13.4,16.57 13.4,20.64 13.03,21.01
  Bottom Layer w0.203: 12.93,21.27 12.93,21.02 13.34,20.6 15.16,20.6 17,22.45
  vias: v2(12.98,21.1)
$1N8540: length 16
  Top Layer w0.203: v2(12,19.91) 12,20.42 11.5,20.93 11.5,22.98 11.72,23.2 15.78,23.2 16.33,23.75 ; v2(9.47,18.8) 9.76,18.8 10.23,18.33 10.23,16.47 9.88,16.47 ; 16.08,25.05 16.23,24.89 16.23,24.09
  Bottom Layer w0.203: v2(9.47,18.8) 9.74,18.53 10.98,18.53 12,19.56 v2(12,19.91)
$1N8553: length 23
  Top Layer w0.203: 7.9,21.68 5.91,21.68 5.72,21.49 5.72,20.23 5.9,20.05 7.15,20.05 7.83,19.36 9.8,19.36 10.91,18.24 10.91,14.68 10.71,14.47 10.11,14.47 ; 7.87,25.06 8.61,25.06 v2(8.79,24.87)
  Top Layer w0.254: 9.86,14.51 8.32,14.51 6.8,12.99
  Bottom Layer w0.203: v2(8.79,24.87) 8.22,24.87 7.54,24.2 7.54,22.3 v2(8.17,21.68)
$1N8819: length 2.5
  Top Layer w0.203: 19.46,25.41 18.69,25.41 17.48,24.2
$1N8855: length 15.7
  Top Layer w0.203: 6.92,20.87 7.92,19.87 9.89,19.87 10.17,20.14 10.63,20.14 10.99,19.77 10.99,19.41 11.79,18.61 11.79,13 13.54,11.25 14.91,11.25
$1N8868: length 3.4
  Top Layer w0.203: 15.85,11.85 16.71,11.85 17.38,11.17 17.38,10.36 17.94,9.81
$1N8989: length 1.4
  Bottom Layer w0.203: 20.26,12.82 20.24,12.8 20.24,11.39
$1N12018: length 9
  Top Layer w0.203: 25.05,15.85 25.04,15.85 23.14,15.85 22.16,14.88 22.16,13.42 v2(21.15,12.4)
  Bottom Layer w0.203: 20.31,9.94 21.15,10.79 v2(21.15,12.4)
$1N12023: length 2.1
  Bottom Layer w0.203: 20.18,15.05 19.78,15.05 18.79,14.06 18.79,13.94 18.67,13.82
$1N16258: length 32.9
  Top Layer w0.203: 9.71,12.58 8.4,12.58 7.44,11.62 7.44,9.26 7.2,9.02 4.63,9.02 4.29,9.36 4.29,9.93 3.21,11.01 1.7,11.01 1.32,11.39 1.32,19.04 3.81,21.53 3.81,21.98
  Bottom Layer w0.203: v2(3.86,21.94) 4.39,21.94 7.93,25.49 9.34,25.49 9.77,25.06 9.77,23.85
$1N16262: length 11.3
  Top Layer w0.203: 10.1,13.22 11.13,13.22 11.42,13.51 11.42,18.47 10.54,19.35
  Bottom Layer w0.203: 11.1,22.96 11.1,20.28 v2(10.4,19.58)
$1N21791: length 2.1
  Top Layer w0.203: 3.69,12.2 3.53,12.35 2.9,12.35 2.29,12.97 2.29,13.35
$1N21794: length 14.2
  Top Layer w0.203: 3.69,13.38 3.46,13.38 2.89,13.95 2.89,17.12 v2(3.33,17.56)
  Top Layer w0.254: 1.6,9.05 1.6,9.78 v2(1.76,9.94) ; 1.6,9.05 2.71,7.94 ; 1.6,9.05 1.6,8.05 ; 1.47,7.92 1.6,8.05
  Bottom Layer w0.203: v2(1.76,9.94) 3.72,11.89 v2(3.72,13.29) ; v2(3.33,17.56) 4.22,16.67 4.29,16.67 4.41,16.55
$1N21871: length 18.6
  Top Layer w0.203: 22.5,8.18 22.5,8.86 21.97,9.39 21,9.39 20.3,8.69 19.41,8.69 ; v2(11.15,11.13) 11.23,11.13 13.17,9.19 16.31,9.19 17.56,7.94
  Bottom Layer w0.203: 7.23,13.02 9.26,13.02 v2(11.15,11.13) ; v2(17.75,8.02) 18.43,8.69 v2(19.4,8.69)
$1N21926: length 4.4
  Bottom Layer w0.203: 7.13,14.84 7.13,17.17 6.29,18.02 5.52,18.02 5.47,18.07
$1N25303: length 10.1
  Top Layer w0.203: 15.03,23.99 15.01,23.97 12.28,23.97
  Top Layer w0.254: 8.73,23.17 8.76,23.17 8.46,23.47 4.95,23.47 ; 12.41,23.8 11.68,23.8 11.3,23.42 9.23,23.42
$1N25434: length 3.8
  Top Layer w0.203: 18.11,11.12 18.11,12.46 18.01,12.56
  Top Layer w0.254: 15.66,12.5 17.97,12.5 18,12.53
$1N26982: length 11.5
  Top Layer w0.203: 27.15,20.47 27.15,19.32 27.2,19.27 ; v2(24.13,19.45) 24.13,19.13 24.74,18.51 26.5,18.51 27.15,19.17 ; v2(22.88,14.22) 23.09,14.43 23.09,15.18 23.36,15.45 24.23,15.45 24.76,14.92
  Bottom Layer w0.203: v2(22.88,14.22) 22.69,14.41 22.69,15.16 ; 22.67,17.84 22.67,18.18 23.94,19.45 v2(24.13,19.45)
$1N26993: length 1.4
  Top Layer w0.203: 27.06,17.78 26.91,17.94 25.68,17.94

## Copper pours and planes (outline as drawn; the poured copper is in the pictures)
GND on Top Layer: -1.19,29.86 30.45,29.86 30.45,-1.7 -1.19,-1.7
GND on Bottom Layer: -1.45,30.08 30.8,30.08 30.8,-1.65 -1.45,-1.65
$1N6734 on Top Layer: 10.89,5.61 11.84,5.61 11.84,4.54 10.89,4.54

## Text on the board
Bottom Silkscreen Layer: OUT | SiDa / 2022/7/7 | LTG-T3 | + | VIN
